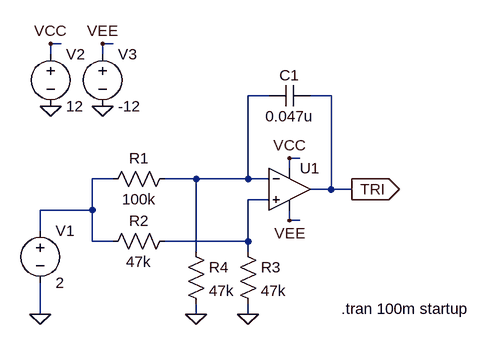
[diagram p0: schematic Integrator_Q1_On.asc]
Integrator_Q1_On.asc, the LTspice schematic file:
Version 4
SHEET 1 880 680
WIRE -144 -80 -160 -80
WIRE -64 -80 -80 -80
WIRE -160 -64 -160 -80
WIRE -80 -64 -80 -80
WIRE 176 0 144 0
WIRE 272 0 240 0
WIRE 224 96 208 96
WIRE 208 112 208 96
WIRE -64 128 -96 128
WIRE 64 128 16 128
WIRE 144 128 144 0
WIRE 144 128 64 128
WIRE 176 128 144 128
WIRE 272 144 272 0
WIRE 272 144 240 144
WIRE 304 144 272 144
WIRE 176 160 144 160
WIRE -96 176 -96 128
WIRE -96 176 -176 176
WIRE 208 192 208 176
WIRE 224 192 208 192
WIRE -176 208 -176 176
WIRE -96 224 -96 176
WIRE -64 224 -96 224
WIRE 144 224 144 160
WIRE 144 224 16 224
WIRE 64 240 64 128
WIRE 144 240 144 224
WIRE -176 336 -176 288
WIRE 64 336 64 320
WIRE 144 336 144 320
FLAG 208 96 VCC
FLAG 208 192 VEE
FLAG 144 336 0
FLAG 304 144 TRI
IOPIN 304 144 Out
FLAG -176 336 0
FLAG -160 16 0
FLAG -80 16 0
FLAG -160 -80 VCC
FLAG -80 -80 VEE
FLAG 64 336 0
SYMBOL Opamps\\UniversalOpamp2 208 144 R0
SYMATTR InstName U1
SYMBOL res 32 112 R90
WINDOW 0 0 56 VBottom 2
WINDOW 3 32 56 VTop 2
SYMATTR InstName R1
SYMATTR Value 100k
SYMBOL res 32 208 R90
WINDOW 0 0 56 VBottom 2
WINDOW 3 32 56 VTop 2
SYMATTR InstName R2
SYMATTR Value 47k
SYMBOL res 128 224 R0
SYMATTR InstName R3
SYMATTR Value 47k
SYMBOL cap 240 -16 R90
WINDOW 0 0 32 VBottom 2
WINDOW 3 32 32 VTop 2
SYMATTR InstName C1
SYMATTR Value 0.047u
SYMBOL voltage -176 192 R0
WINDOW 123 0 0 Left 2
WINDOW 39 0 0 Left 2
SYMATTR InstName V1
SYMATTR Value 2
SYMBOL voltage -160 -80 R0
WINDOW 123 0 0 Left 2
WINDOW 39 0 0 Left 2
SYMATTR InstName V2
SYMATTR Value 12
SYMBOL voltage -80 -80 R0
WINDOW 123 0 0 Left 2
WINDOW 39 0 0 Left 2
SYMATTR InstName V3
SYMATTR Value -12
SYMBOL res 48 224 R0
SYMATTR InstName R4
SYMATTR Value 47k
TEXT 288 328 Left 2 !.tran 100m startup

The netlist it stands for:
* Integrator_Q1_On.asc
XU1 N003 N001 VCC VEE TRI level.2 Avol=1Meg GBW=10Meg Slew=10Meg ilimit=25m rail=0 Vos=0 phimargin=45 en=0 enk=0 in=0 ink=0 Rin=500Meg  ; pins IN+ IN- V+ V- OUT
R1 N001 N002 100k
R2 N003 N002 47k
R3 N003 0 47k
C1 TRI N001 0.047u
V1 N002 0 2
V2 VCC 0 12
V3 VEE 0 -12
R4 N001 0 47k
.tran 100m startup
.lib UniversalOpamps2.sub
.backanno
.end